# Altium schematic sheet Principal.SchDoc
size A3; Author: Thomas Kreppel; CompanyName: Universidad de Santiago de Chile; Address1: Avenida Ecuador Nº 3519; Address2: Estación Central, Santiago; Address3: Chile; DocumentNumber: 1; SheetNumber: 1; SheetTotal: 6
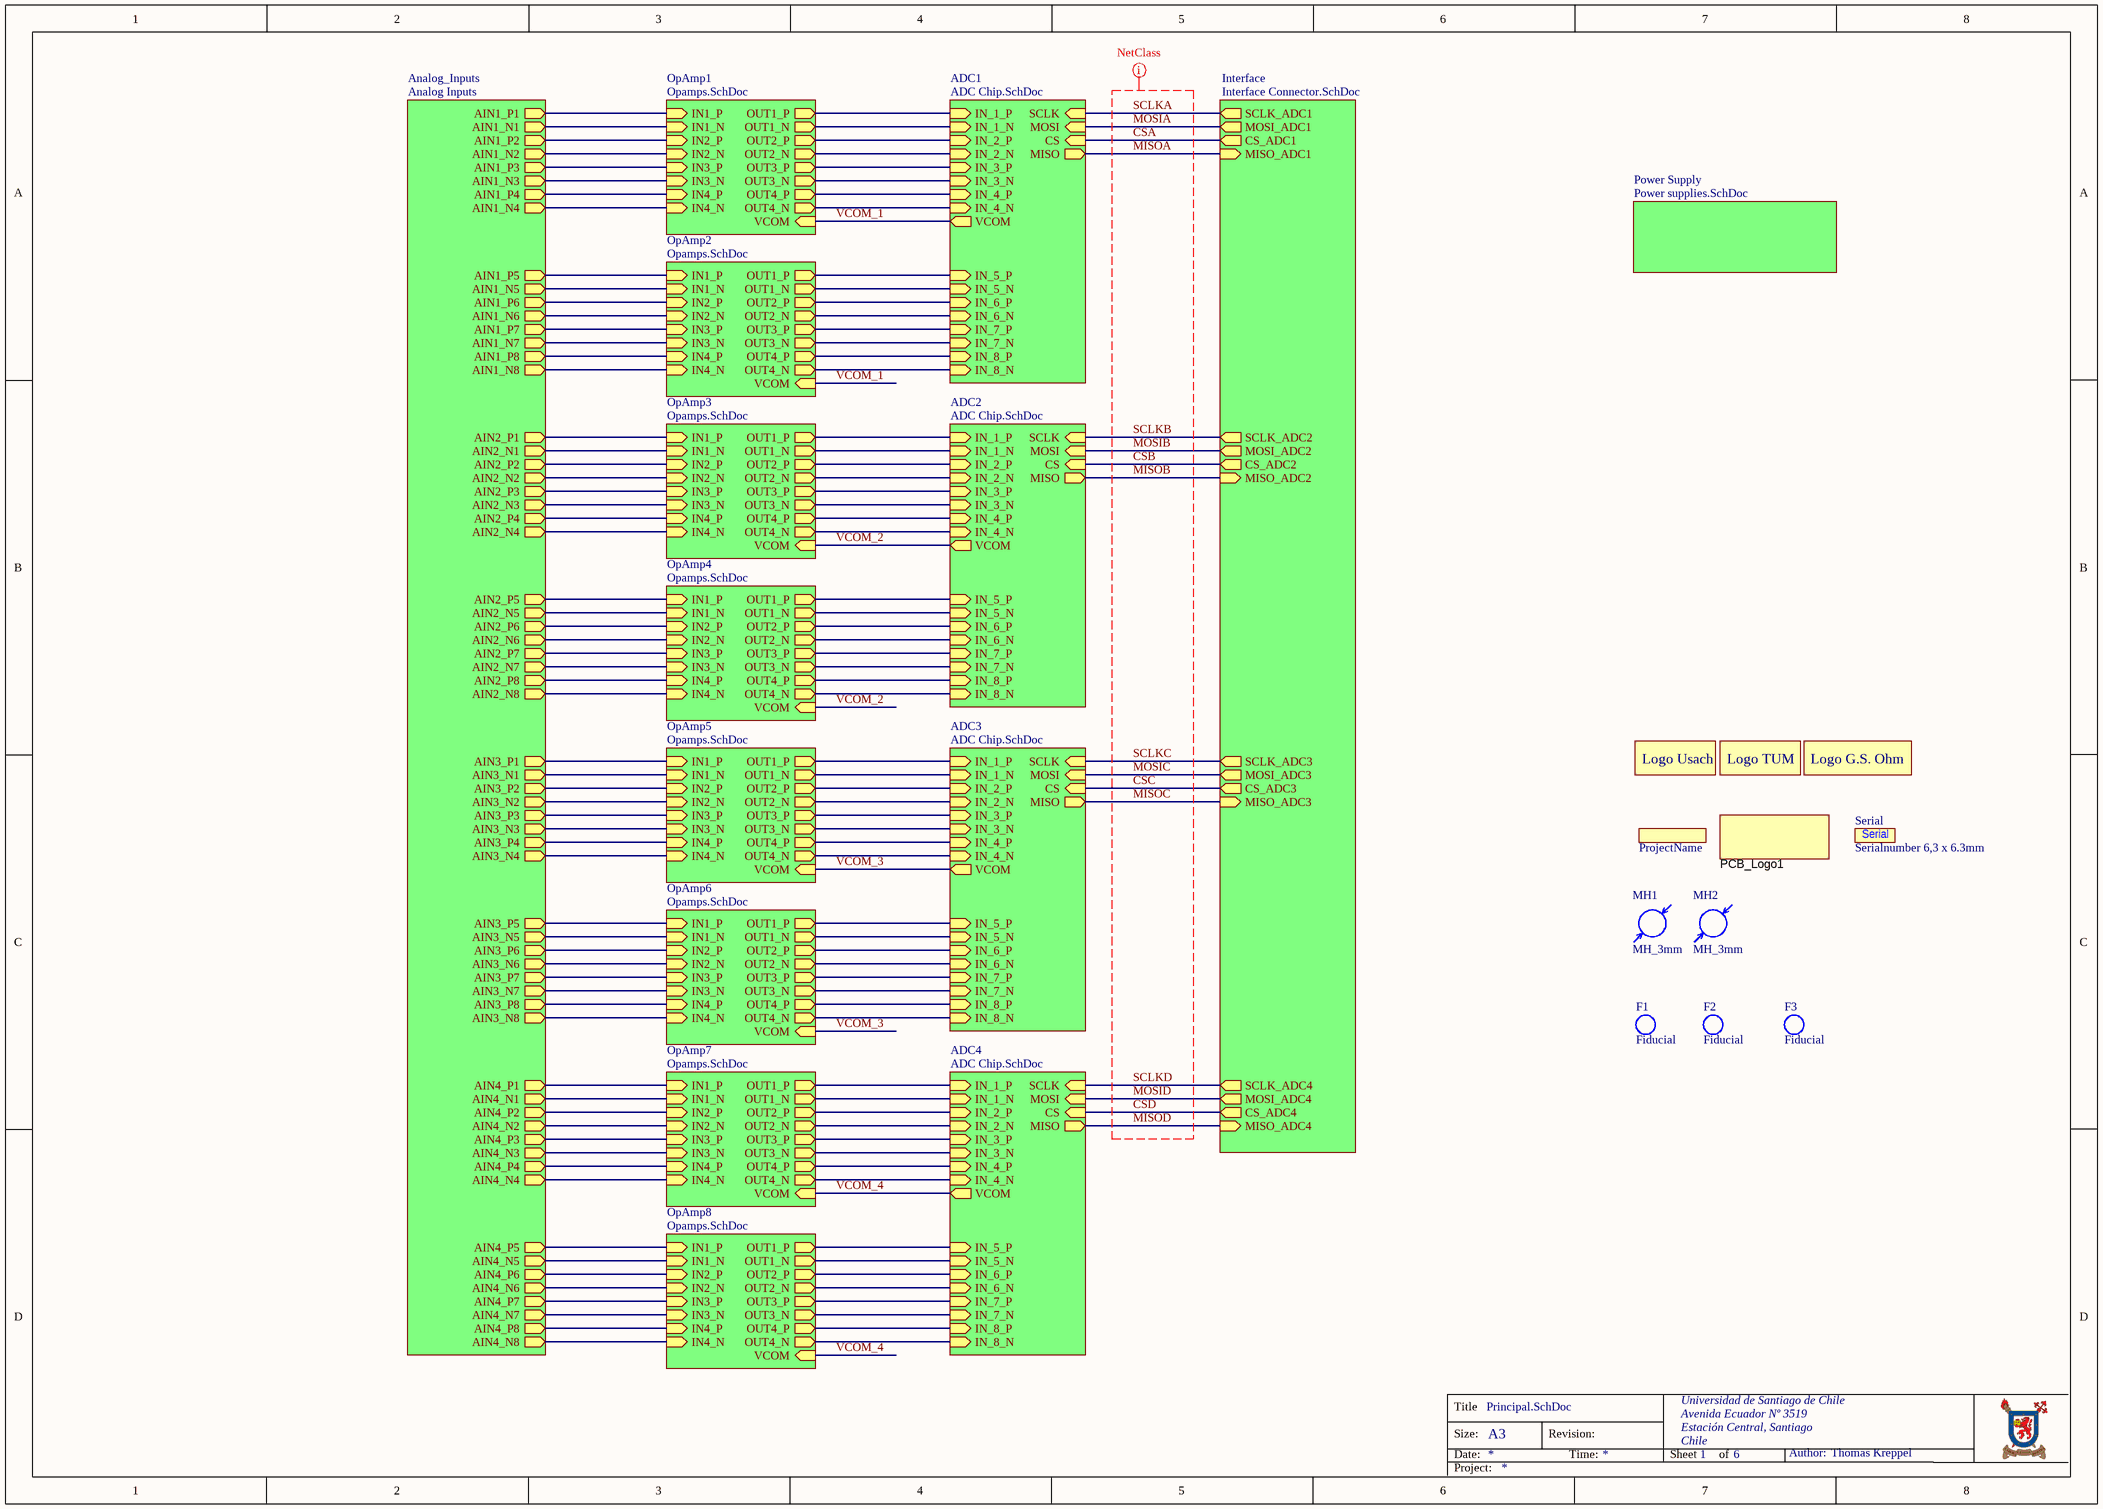
[diagram p0: Principal.SchDoc]

## Parts
F1  Fiducial  [Fiducial_1.7mm]  (no BOM)
F2  Fiducial  [Fiducial_1.7mm]  (no BOM)
F3  Fiducial  [Fiducial_1.7mm]  (no BOM)
Logo1  LOGO USACH  [Logo Usach]  (value not drawn)  (no BOM)
Logo2  LOGO TUM  [Logo TUM]  (value not drawn)  (no BOM)
Logo3  LOGO G.S. Ohm  [Logo G.S.Ohm University]  (value not drawn)  (no BOM)
MH1  MH_3mm  [Mounting Hole]  (no BOM)
MH2  MH_3mm  [Mounting Hole]  (no BOM)
PCB_Logo1  ESD Susceptible  [ESD_Overlay_Medium]  (value not drawn)  (no BOM)
ProjectName  Project Name, Rev  [ID_ProjectRev]  (value not drawn)  (no BOM)
Serial  Serialnumber 6,3 x 6.3mm  [Serial_6.3x6.3mm]  (no BOM)

## Sub-sheets
ADC1 = ADC Chip.SchDoc: IN_1_P (in), IN_7_N (in), IN_5_P (in), IN_4_P (in), IN_1_N (in), MOSI (in), IN_6_P (in), IN_2_P (in), IN_2_N (in), IN_5_N (in), CS (in), IN_6_N (in), IN_3_N (in), IN_8_N (in), IN_7_P (in), IN_4_N (in), MISO (out), IN_8_P (in), SCLK (in), IN_3_P (in), VCOM (out)
ADC2 = ADC Chip.SchDoc: IN_1_P (in), IN_7_N (in), IN_5_P (in), IN_4_P (in), IN_1_N (in), MOSI (in), IN_6_P (in), IN_2_P (in), IN_2_N (in), IN_5_N (in), CS (in), IN_6_N (in), IN_3_N (in), IN_8_N (in), IN_7_P (in), IN_4_N (in), MISO (out), IN_8_P (in), SCLK (in), IN_3_P (in), VCOM (out)
ADC3 = ADC Chip.SchDoc: IN_1_P (in), IN_7_N (in), IN_5_P (in), IN_4_P (in), IN_1_N (in), MOSI (in), IN_6_P (in), IN_2_P (in), IN_2_N (in), IN_5_N (in), CS (in), IN_6_N (in), IN_3_N (in), IN_8_N (in), IN_7_P (in), IN_4_N (in), MISO (out), IN_8_P (in), SCLK (in), IN_3_P (in), VCOM (out)
ADC4 = ADC Chip.SchDoc: IN_1_P (in), IN_7_N (in), IN_5_P (in), IN_4_P (in), IN_1_N (in), MOSI (in), IN_6_P (in), IN_2_P (in), IN_2_N (in), IN_5_N (in), CS (in), IN_6_N (in), IN_3_N (in), IN_8_N (in), IN_7_P (in), IN_4_N (in), MISO (out), IN_8_P (in), SCLK (in), IN_3_P (in), VCOM (out)
Analog_Inputs = Analog Inputs: AIN1_N1 (out), AIN1_P1 (out), AIN1_N8 (out), AIN1_N7 (out), AIN2_N1 (out), AIN2_P1 (out), AIN2_P6 (out), AIN1_P2 (out), AIN1_P3 (out), AIN2_P2 (out), AIN2_P4 (out), AIN2_P8 (out), AIN1_P7 (out), AIN1_P5 (out), AIN1_N3 (out), AIN1_N2 (out), AIN1_N5 (out), AIN2_P5 (out), AIN1_P6 (out), AIN1_N4 (out), AIN1_P8 (out), AIN2_P3 (out), AIN2_P7 (out), AIN1_P4 (out), AIN1_N6 (out), AIN4_P8 (out), AIN3_P2 (out), AIN3_P7 (out), AIN2_N7 (out), AIN4_N3 (out), AIN2_N3 (out), AIN3_P1 (out), AIN4_P5 (out), AIN3_P5 (out), AIN3_N7 (out), AIN4_N2 (out), AIN4_N1 (out), AIN3_P4 (out), AIN4_P7 (out), AIN4_P3 (out), AIN3_P6 (out), AIN3_N1 (out), AIN4_N7 (out), AIN3_P8 (out), AIN4_N8 (out), AIN3_N3 (out), AIN2_N5 (out), AIN2_N4 (out), AIN4_P4 (out), AIN3_N2 (out), AIN4_N5 (out), AIN2_N8 (out), AIN3_N6 (out), AIN4_P1 (out), AIN4_N4 (out), AIN3_N4 (out), AIN2_N6 (out), AIN4_P2 (out), AIN4_P6 (out), AIN3_N8 (out), AIN4_N6 (out), AIN2_N2 (out), AIN3_N5 (out), AIN3_P3 (out)
Interface = Interface Connector.SchDoc: CS_ADC2 (out), CS_ADC4 (out), SCLK_ADC2 (out), SCLK_ADC4 (out), CS_ADC1 (out), MISO_ADC1 (in), MOSI_ADC4 (out), CS_ADC3 (out), SCLK_ADC3 (out), MOSI_ADC2 (out), MOSI_ADC3 (out), MISO_ADC4 (in), MISO_ADC3 (in), MISO_ADC2 (in), SCLK_ADC1 (out), MOSI_ADC1 (out)
OpAmp1 = Opamps.SchDoc: IN2_P (in), IN1_N (in), OUT3_P (out), IN4_P (in), IN3_N (in), OUT3_N (out), IN4_N (in), OUT4_N (out), OUT4_P (out), IN2_N (in), OUT1_N (out), OUT2_N (out), OUT1_P (out), VCOM (in), IN3_P (in), OUT2_P (out), IN1_P (in)
OpAmp2 = Opamps.SchDoc: IN2_P (in), IN1_N (in), OUT3_P (out), IN4_P (in), IN3_N (in), OUT3_N (out), IN4_N (in), OUT4_N (out), OUT4_P (out), IN2_N (in), OUT1_N (out), OUT2_N (out), OUT1_P (out), VCOM (in), IN3_P (in), OUT2_P (out), IN1_P (in)
OpAmp3 = Opamps.SchDoc: IN2_P (in), IN1_N (in), OUT3_P (out), IN4_P (in), IN3_N (in), OUT3_N (out), IN4_N (in), OUT4_N (out), OUT4_P (out), IN2_N (in), OUT1_N (out), OUT2_N (out), OUT1_P (out), VCOM (in), IN3_P (in), OUT2_P (out), IN1_P (in)
OpAmp4 = Opamps.SchDoc: IN2_P (in), IN1_N (in), OUT3_P (out), IN4_P (in), IN3_N (in), OUT3_N (out), IN4_N (in), OUT4_N (out), OUT4_P (out), IN2_N (in), OUT1_N (out), OUT2_N (out), OUT1_P (out), VCOM (in), IN3_P (in), OUT2_P (out), IN1_P (in)
OpAmp5 = Opamps.SchDoc: IN2_P (in), IN1_N (in), OUT3_P (out), IN4_P (in), IN3_N (in), OUT3_N (out), IN4_N (in), OUT4_N (out), OUT4_P (out), IN2_N (in), OUT1_N (out), OUT2_N (out), OUT1_P (out), VCOM (in), IN3_P (in), OUT2_P (out), IN1_P (in)
OpAmp6 = Opamps.SchDoc: IN2_P (in), IN1_N (in), OUT3_P (out), IN4_P (in), IN3_N (in), OUT3_N (out), IN4_N (in), OUT4_N (out), OUT4_P (out), IN2_N (in), OUT1_N (out), OUT2_N (out), OUT1_P (out), VCOM (in), IN3_P (in), OUT2_P (out), IN1_P (in)
OpAmp7 = Opamps.SchDoc: IN2_P (in), IN1_N (in), OUT3_P (out), IN4_P (in), IN3_N (in), OUT3_N (out), IN4_N (in), OUT4_N (out), OUT4_P (out), IN2_N (in), OUT1_N (out), OUT2_N (out), OUT1_P (out), VCOM (in), IN3_P (in), OUT2_P (out), IN1_P (in)
OpAmp8 = Opamps.SchDoc: IN2_P (in), IN1_N (in), OUT3_P (out), IN4_P (in), IN3_N (in), OUT3_N (out), IN4_N (in), OUT4_N (out), OUT4_P (out), IN2_N (in), OUT1_N (out), OUT2_N (out), OUT1_P (out), VCOM (in), IN3_P (in), OUT2_P (out), IN1_P (in)
Power Supply = Power supplies.SchDoc: no entries

## Nets
CSA: sheet Interface/CS_ADC1, sheet ADC1/CS
CSB: sheet Interface/CS_ADC2, sheet ADC2/CS
CSC: sheet Interface/CS_ADC3, sheet ADC3/CS
CSD: sheet Interface/CS_ADC4, sheet ADC4/CS
MISOA: sheet Interface/MISO_ADC1, sheet ADC1/MISO
MISOB: sheet Interface/MISO_ADC2, sheet ADC2/MISO
MISOC: sheet Interface/MISO_ADC3, sheet ADC3/MISO
MISOD: sheet Interface/MISO_ADC4, sheet ADC4/MISO
MOSIA: sheet Interface/MOSI_ADC1, sheet ADC1/MOSI
MOSIB: sheet Interface/MOSI_ADC2, sheet ADC2/MOSI
MOSIC: sheet Interface/MOSI_ADC3, sheet ADC3/MOSI
MOSID: sheet Interface/MOSI_ADC4, sheet ADC4/MOSI
SCLKA: sheet Interface/SCLK_ADC1, sheet ADC1/SCLK
SCLKB: sheet Interface/SCLK_ADC2, sheet ADC2/SCLK
SCLKC: sheet Interface/SCLK_ADC3, sheet ADC3/SCLK
SCLKD: sheet Interface/SCLK_ADC4, sheet ADC4/SCLK
VCOM_1: sheet ADC1/VCOM, sheet OpAmp1/VCOM, sheet OpAmp2/VCOM
VCOM_2: sheet ADC2/VCOM, sheet OpAmp3/VCOM, sheet OpAmp4/VCOM
VCOM_3: sheet ADC3/VCOM, sheet OpAmp5/VCOM, sheet OpAmp6/VCOM
VCOM_4: sheet ADC4/VCOM, sheet OpAmp7/VCOM, sheet OpAmp8/VCOM
(unnamed): sheet Analog_Inputs/AIN1_N1, sheet OpAmp1/IN1_N
(unnamed): sheet Analog_Inputs/AIN1_P1, sheet OpAmp1/IN1_P
(unnamed): sheet Analog_Inputs/AIN1_N8, sheet OpAmp2/IN4_N
(unnamed): sheet Analog_Inputs/AIN1_N7, sheet OpAmp2/IN3_N
(unnamed): sheet Analog_Inputs/AIN2_N1, sheet OpAmp3/IN1_N
(unnamed): sheet Analog_Inputs/AIN2_P1, sheet OpAmp3/IN1_P
(unnamed): sheet Analog_Inputs/AIN2_P6, sheet OpAmp4/IN2_P
(unnamed): sheet Analog_Inputs/AIN1_P2, sheet OpAmp1/IN2_P
(unnamed): sheet Analog_Inputs/AIN1_P3, sheet OpAmp1/IN3_P
(unnamed): sheet Analog_Inputs/AIN2_P2, sheet OpAmp3/IN2_P
(unnamed): sheet Analog_Inputs/AIN2_P4, sheet OpAmp3/IN4_P
(unnamed): sheet Analog_Inputs/AIN2_P8, sheet OpAmp4/IN4_P
(unnamed): sheet Analog_Inputs/AIN1_P7, sheet OpAmp2/IN3_P
(unnamed): sheet Analog_Inputs/AIN1_P5, sheet OpAmp2/IN1_P
(unnamed): sheet Analog_Inputs/AIN1_N3, sheet OpAmp1/IN3_N
(unnamed): sheet Analog_Inputs/AIN1_N2, sheet OpAmp1/IN2_N
(unnamed): sheet Analog_Inputs/AIN1_N5, sheet OpAmp2/IN1_N
(unnamed): sheet Analog_Inputs/AIN2_P5, sheet OpAmp4/IN1_P
(unnamed): sheet Analog_Inputs/AIN1_P6, sheet OpAmp2/IN2_P
(unnamed): sheet Analog_Inputs/AIN1_N4, sheet OpAmp1/IN4_N
(unnamed): sheet Analog_Inputs/AIN1_P8, sheet OpAmp2/IN4_P
(unnamed): sheet Analog_Inputs/AIN2_P3, sheet OpAmp3/IN3_P
(unnamed): sheet Analog_Inputs/AIN2_P7, sheet OpAmp4/IN3_P
(unnamed): sheet Analog_Inputs/AIN1_P4, sheet OpAmp1/IN4_P
(unnamed): sheet Analog_Inputs/AIN1_N6, sheet OpAmp2/IN2_N
(unnamed): sheet Analog_Inputs/AIN4_P8, sheet OpAmp8/IN4_P
(unnamed): sheet Analog_Inputs/AIN3_P2, sheet OpAmp5/IN2_P
(unnamed): sheet Analog_Inputs/AIN3_P7, sheet OpAmp6/IN3_P
(unnamed): sheet Analog_Inputs/AIN2_N7, sheet OpAmp4/IN3_N
(unnamed): sheet Analog_Inputs/AIN4_N3, sheet OpAmp7/IN3_N
(unnamed): sheet Analog_Inputs/AIN2_N3, sheet OpAmp3/IN3_N
(unnamed): sheet Analog_Inputs/AIN3_P1, sheet OpAmp5/IN1_P
(unnamed): sheet Analog_Inputs/AIN4_P5, sheet OpAmp8/IN1_P
(unnamed): sheet Analog_Inputs/AIN3_P5, sheet OpAmp6/IN1_P
(unnamed): sheet Analog_Inputs/AIN3_N7, sheet OpAmp6/IN3_N
(unnamed): sheet Analog_Inputs/AIN4_N2, sheet OpAmp7/IN2_N
(unnamed): sheet Analog_Inputs/AIN4_N1, sheet OpAmp7/IN1_N
(unnamed): sheet Analog_Inputs/AIN3_P4, sheet OpAmp5/IN4_P
(unnamed): sheet Analog_Inputs/AIN4_P7, sheet OpAmp8/IN3_P
(unnamed): sheet Analog_Inputs/AIN4_P3, sheet OpAmp7/IN3_P
(unnamed): sheet Analog_Inputs/AIN3_P6, sheet OpAmp6/IN2_P
(unnamed): sheet Analog_Inputs/AIN3_N1, sheet OpAmp5/IN1_N
(unnamed): sheet Analog_Inputs/AIN4_N7, sheet OpAmp8/IN3_N
(unnamed): sheet Analog_Inputs/AIN3_P8, sheet OpAmp6/IN4_P
(unnamed): sheet Analog_Inputs/AIN4_N8, sheet OpAmp8/IN4_N
(unnamed): sheet Analog_Inputs/AIN3_N3, sheet OpAmp5/IN3_N
(unnamed): sheet Analog_Inputs/AIN2_N5, sheet OpAmp4/IN1_N
(unnamed): sheet Analog_Inputs/AIN2_N4, sheet OpAmp3/IN4_N
(unnamed): sheet Analog_Inputs/AIN4_P4, sheet OpAmp7/IN4_P
(unnamed): sheet Analog_Inputs/AIN3_N2, sheet OpAmp5/IN2_N
(unnamed): sheet Analog_Inputs/AIN4_N5, sheet OpAmp8/IN1_N
(unnamed): sheet Analog_Inputs/AIN2_N8, sheet OpAmp4/IN4_N
(unnamed): sheet Analog_Inputs/AIN3_N6, sheet OpAmp6/IN2_N
(unnamed): sheet Analog_Inputs/AIN4_P1, sheet OpAmp7/IN1_P
(unnamed): sheet Analog_Inputs/AIN4_N4, sheet OpAmp7/IN4_N
(unnamed): sheet Analog_Inputs/AIN3_N4, sheet OpAmp5/IN4_N
(unnamed): sheet Analog_Inputs/AIN2_N6, sheet OpAmp4/IN2_N
(unnamed): sheet Analog_Inputs/AIN4_P2, sheet OpAmp7/IN2_P
(unnamed): sheet Analog_Inputs/AIN4_P6, sheet OpAmp8/IN2_P
(unnamed): sheet Analog_Inputs/AIN3_N8, sheet OpAmp6/IN4_N
(unnamed): sheet Analog_Inputs/AIN4_N6, sheet OpAmp8/IN2_N
(unnamed): sheet Analog_Inputs/AIN2_N2, sheet OpAmp3/IN2_N
(unnamed): sheet Analog_Inputs/AIN3_N5, sheet OpAmp6/IN1_N
(unnamed): sheet Analog_Inputs/AIN3_P3, sheet OpAmp5/IN3_P
(unnamed): sheet ADC1/IN_1_P, sheet OpAmp1/OUT1_P
(unnamed): sheet ADC1/IN_7_N, sheet OpAmp2/OUT3_N
(unnamed): sheet ADC1/IN_5_P, sheet OpAmp2/OUT1_P
(unnamed): sheet ADC1/IN_4_P, sheet OpAmp1/OUT4_P
(unnamed): sheet ADC1/IN_1_N, sheet OpAmp1/OUT1_N
(unnamed): sheet ADC1/IN_6_P, sheet OpAmp2/OUT2_P
(unnamed): sheet ADC1/IN_2_P, sheet OpAmp1/OUT2_P
(unnamed): sheet ADC1/IN_2_N, sheet OpAmp1/OUT2_N
(unnamed): sheet ADC1/IN_5_N, sheet OpAmp2/OUT1_N
(unnamed): sheet ADC1/IN_6_N, sheet OpAmp2/OUT2_N
(unnamed): sheet ADC1/IN_3_N, sheet OpAmp1/OUT3_N
(unnamed): sheet ADC1/IN_8_N, sheet OpAmp2/OUT4_N
(unnamed): sheet ADC1/IN_7_P, sheet OpAmp2/OUT3_P
(unnamed): sheet ADC1/IN_4_N, sheet OpAmp1/OUT4_N
(unnamed): sheet ADC1/IN_8_P, sheet OpAmp2/OUT4_P
(unnamed): sheet ADC1/IN_3_P, sheet OpAmp1/OUT3_P
(unnamed): sheet ADC2/IN_1_P, sheet OpAmp3/OUT1_P
(unnamed): sheet ADC2/IN_7_N, sheet OpAmp4/OUT3_N
(unnamed): sheet ADC2/IN_5_P, sheet OpAmp4/OUT1_P
(unnamed): sheet ADC2/IN_4_P, sheet OpAmp3/OUT4_P
(unnamed): sheet ADC2/IN_1_N, sheet OpAmp3/OUT1_N
(unnamed): sheet ADC2/IN_6_P, sheet OpAmp4/OUT2_P
(unnamed): sheet ADC2/IN_2_P, sheet OpAmp3/OUT2_P
(unnamed): sheet ADC2/IN_2_N, sheet OpAmp3/OUT2_N
(unnamed): sheet ADC2/IN_5_N, sheet OpAmp4/OUT1_N
(unnamed): sheet ADC2/IN_6_N, sheet OpAmp4/OUT2_N
(unnamed): sheet ADC2/IN_3_N, sheet OpAmp3/OUT3_N
(unnamed): sheet ADC2/IN_8_N, sheet OpAmp4/OUT4_N
(unnamed): sheet ADC2/IN_7_P, sheet OpAmp4/OUT3_P
(unnamed): sheet ADC2/IN_4_N, sheet OpAmp3/OUT4_N
(unnamed): sheet ADC2/IN_8_P, sheet OpAmp4/OUT4_P
(unnamed): sheet ADC2/IN_3_P, sheet OpAmp3/OUT3_P
(unnamed): sheet ADC3/IN_1_P, sheet OpAmp5/OUT1_P
(unnamed): sheet ADC3/IN_7_N, sheet OpAmp6/OUT3_N
(unnamed): sheet ADC3/IN_5_P, sheet OpAmp6/OUT1_P
(unnamed): sheet ADC3/IN_4_P, sheet OpAmp5/OUT4_P
(unnamed): sheet ADC3/IN_1_N, sheet OpAmp5/OUT1_N
(unnamed): sheet ADC3/IN_6_P, sheet OpAmp6/OUT2_P
(unnamed): sheet ADC3/IN_2_P, sheet OpAmp5/OUT2_P
(unnamed): sheet ADC3/IN_2_N, sheet OpAmp5/OUT2_N
(unnamed): sheet ADC3/IN_5_N, sheet OpAmp6/OUT1_N
(unnamed): sheet ADC3/IN_6_N, sheet OpAmp6/OUT2_N
(unnamed): sheet ADC3/IN_3_N, sheet OpAmp5/OUT3_N
(unnamed): sheet ADC3/IN_8_N, sheet OpAmp6/OUT4_N
(unnamed): sheet ADC3/IN_7_P, sheet OpAmp6/OUT3_P
(unnamed): sheet ADC3/IN_4_N, sheet OpAmp5/OUT4_N
(unnamed): sheet ADC3/IN_8_P, sheet OpAmp6/OUT4_P
(unnamed): sheet ADC3/IN_3_P, sheet OpAmp5/OUT3_P
(unnamed): sheet ADC4/IN_1_P, sheet OpAmp7/OUT1_P
(unnamed): sheet ADC4/IN_7_N, sheet OpAmp8/OUT3_N
(unnamed): sheet ADC4/IN_5_P, sheet OpAmp8/OUT1_P
(unnamed): sheet ADC4/IN_4_P, sheet OpAmp7/OUT4_P
(unnamed): sheet ADC4/IN_1_N, sheet OpAmp7/OUT1_N
(unnamed): sheet ADC4/IN_6_P, sheet OpAmp8/OUT2_P
(unnamed): sheet ADC4/IN_2_P, sheet OpAmp7/OUT2_P
(unnamed): sheet ADC4/IN_2_N, sheet OpAmp7/OUT2_N
(unnamed): sheet ADC4/IN_5_N, sheet OpAmp8/OUT1_N
(unnamed): sheet ADC4/IN_6_N, sheet OpAmp8/OUT2_N
(unnamed): sheet ADC4/IN_3_N, sheet OpAmp7/OUT3_N
(unnamed): sheet ADC4/IN_8_N, sheet OpAmp8/OUT4_N
(unnamed): sheet ADC4/IN_7_P, sheet OpAmp8/OUT3_P
(unnamed): sheet ADC4/IN_4_N, sheet OpAmp7/OUT4_N
(unnamed): sheet ADC4/IN_8_P, sheet OpAmp8/OUT4_P
(unnamed): sheet ADC4/IN_3_P, sheet OpAmp7/OUT3_P

## Layout directives
net class Match_single: CSA, CSB, CSC, CSD, MISOA, MISOB, MISOC, MISOD, MOSIA, MOSIB, MOSIC, MOSID, SCLKA, SCLKB, SCLKC, SCLKD

## Notes on the sheet
- Title
- Size:
- Date:
- A3
- Revision:
- Time:
- Sheet
- of
- Author:
- Project:
- (in symbol LOGO G.S. Ohm) Logo G.S. Ohm
- (in symbol LOGO TUM) Logo TUM
- (in symbol LOGO USACH) Logo Usach

## Library data of the parts
F1-F3 = Fiducial: Fiducial for Assembler
PCB_Logo1 = LOGO_ESD_Susceptible: ESD Susceptible Symbol; Created: 2018_11_25_AGeiger; Value: ESD Susceptible
ProjectName = ID_ProjectRev: Project Name and Revision Number; Created: 2018_11_23_AGeiger; Value: Project Name, Rev
Serial = SerialNumber: Created: 2018_09_18_AGeiger; Value: Serialnumber 6,3 x 6.3mm